# Altium schematic sheet icm-42688-p.SchDoc
size A4; SheetNumber: 8; SheetTotal: 11
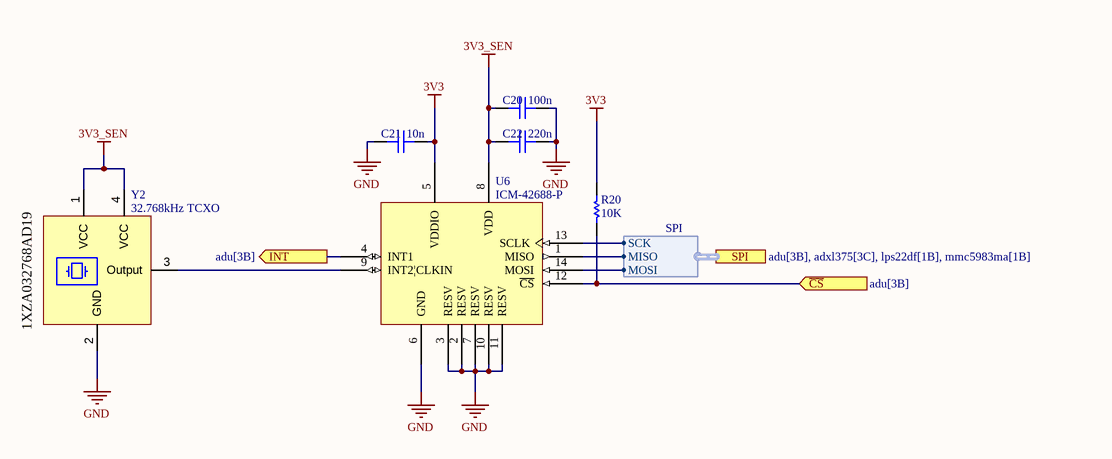
[diagram p0: icm-42688-p.SchDoc]

## Parts
C20  100n  [CAP-0603-NP]
C21  10n  [CAP-0603-NP]
C22  220n  [CAP-0603-NP]
R20  10K  [RES-0603]
U6  ICM-42688-P  [ICM-42688-P]
Y2  32.768kHz TCXO  [DSK321STD]

## Ports
INT (out, see adu[3B]), SPI (harness SPI, see adu[3B], adxl375[3C], lps22df[1B], mmc5983ma[1B]), ~{CS} (in, see adu[3B])

## Harnesses
SPI: MISO, MOSI, SCK

## Nets
3V3: C21.2 R20.2 U6.5(VDDIO)
3V3_SEN: C20.1 C22.1 U6.8(VDD) Y2.1(VCC) Y2.4(VCC)
GND: C20.2 C21.1 C22.2 U6.2(RESV) U6.3(RESV) U6.6(GND) U6.7(RESV) U6.10(RESV) U6.11(RESV) Y2.2(GND)
~{CS}: R20.1 U6.12(~{CS}) ; port ~{CS}
INT: U6.4(INT1) ; port INT
NetU6_1: U6.1(MISO) ; port SPI.MISO
NetU6_9: U6.9(INT2|CLKIN) Y2.3(Output)
NetU6_13: U6.13(SCLK) ; port SPI.SCK
NetU6_14: U6.14(MOSI) ; port SPI.MOSI

## Notes on the sheet
- (near Y2) 1XZA032768AD19

## Library data of the parts
C20-C22 = Capacitor
R20 = Resistor
U6 = ICM-42688-P: High Precision 6-Axis MEMS Gyro and Accelerometer
Y2 = TCXO-4Pin: 3.3V ±5ppm 32.768kHz SMD3225-4P Temperature Compensated Crystal Oscillators (TCXOs) ROHS